# Altium schematic sheet Sheet1 (2).SchDoc
size 420 x 297 mm; Address1: Address1; Address2: Address2; Address3: Address3; Address4: Address4; DocumentNumber: АБВГ.123456.001 Э3; SheetNumber: 1; SheetTotal: 2; Scale: 1:1; Title2str: Макет преобразователя частоты вращения.; DocumentType: Схема электрическая принципиальная; FirstReferrence: АБВГ.123456.001
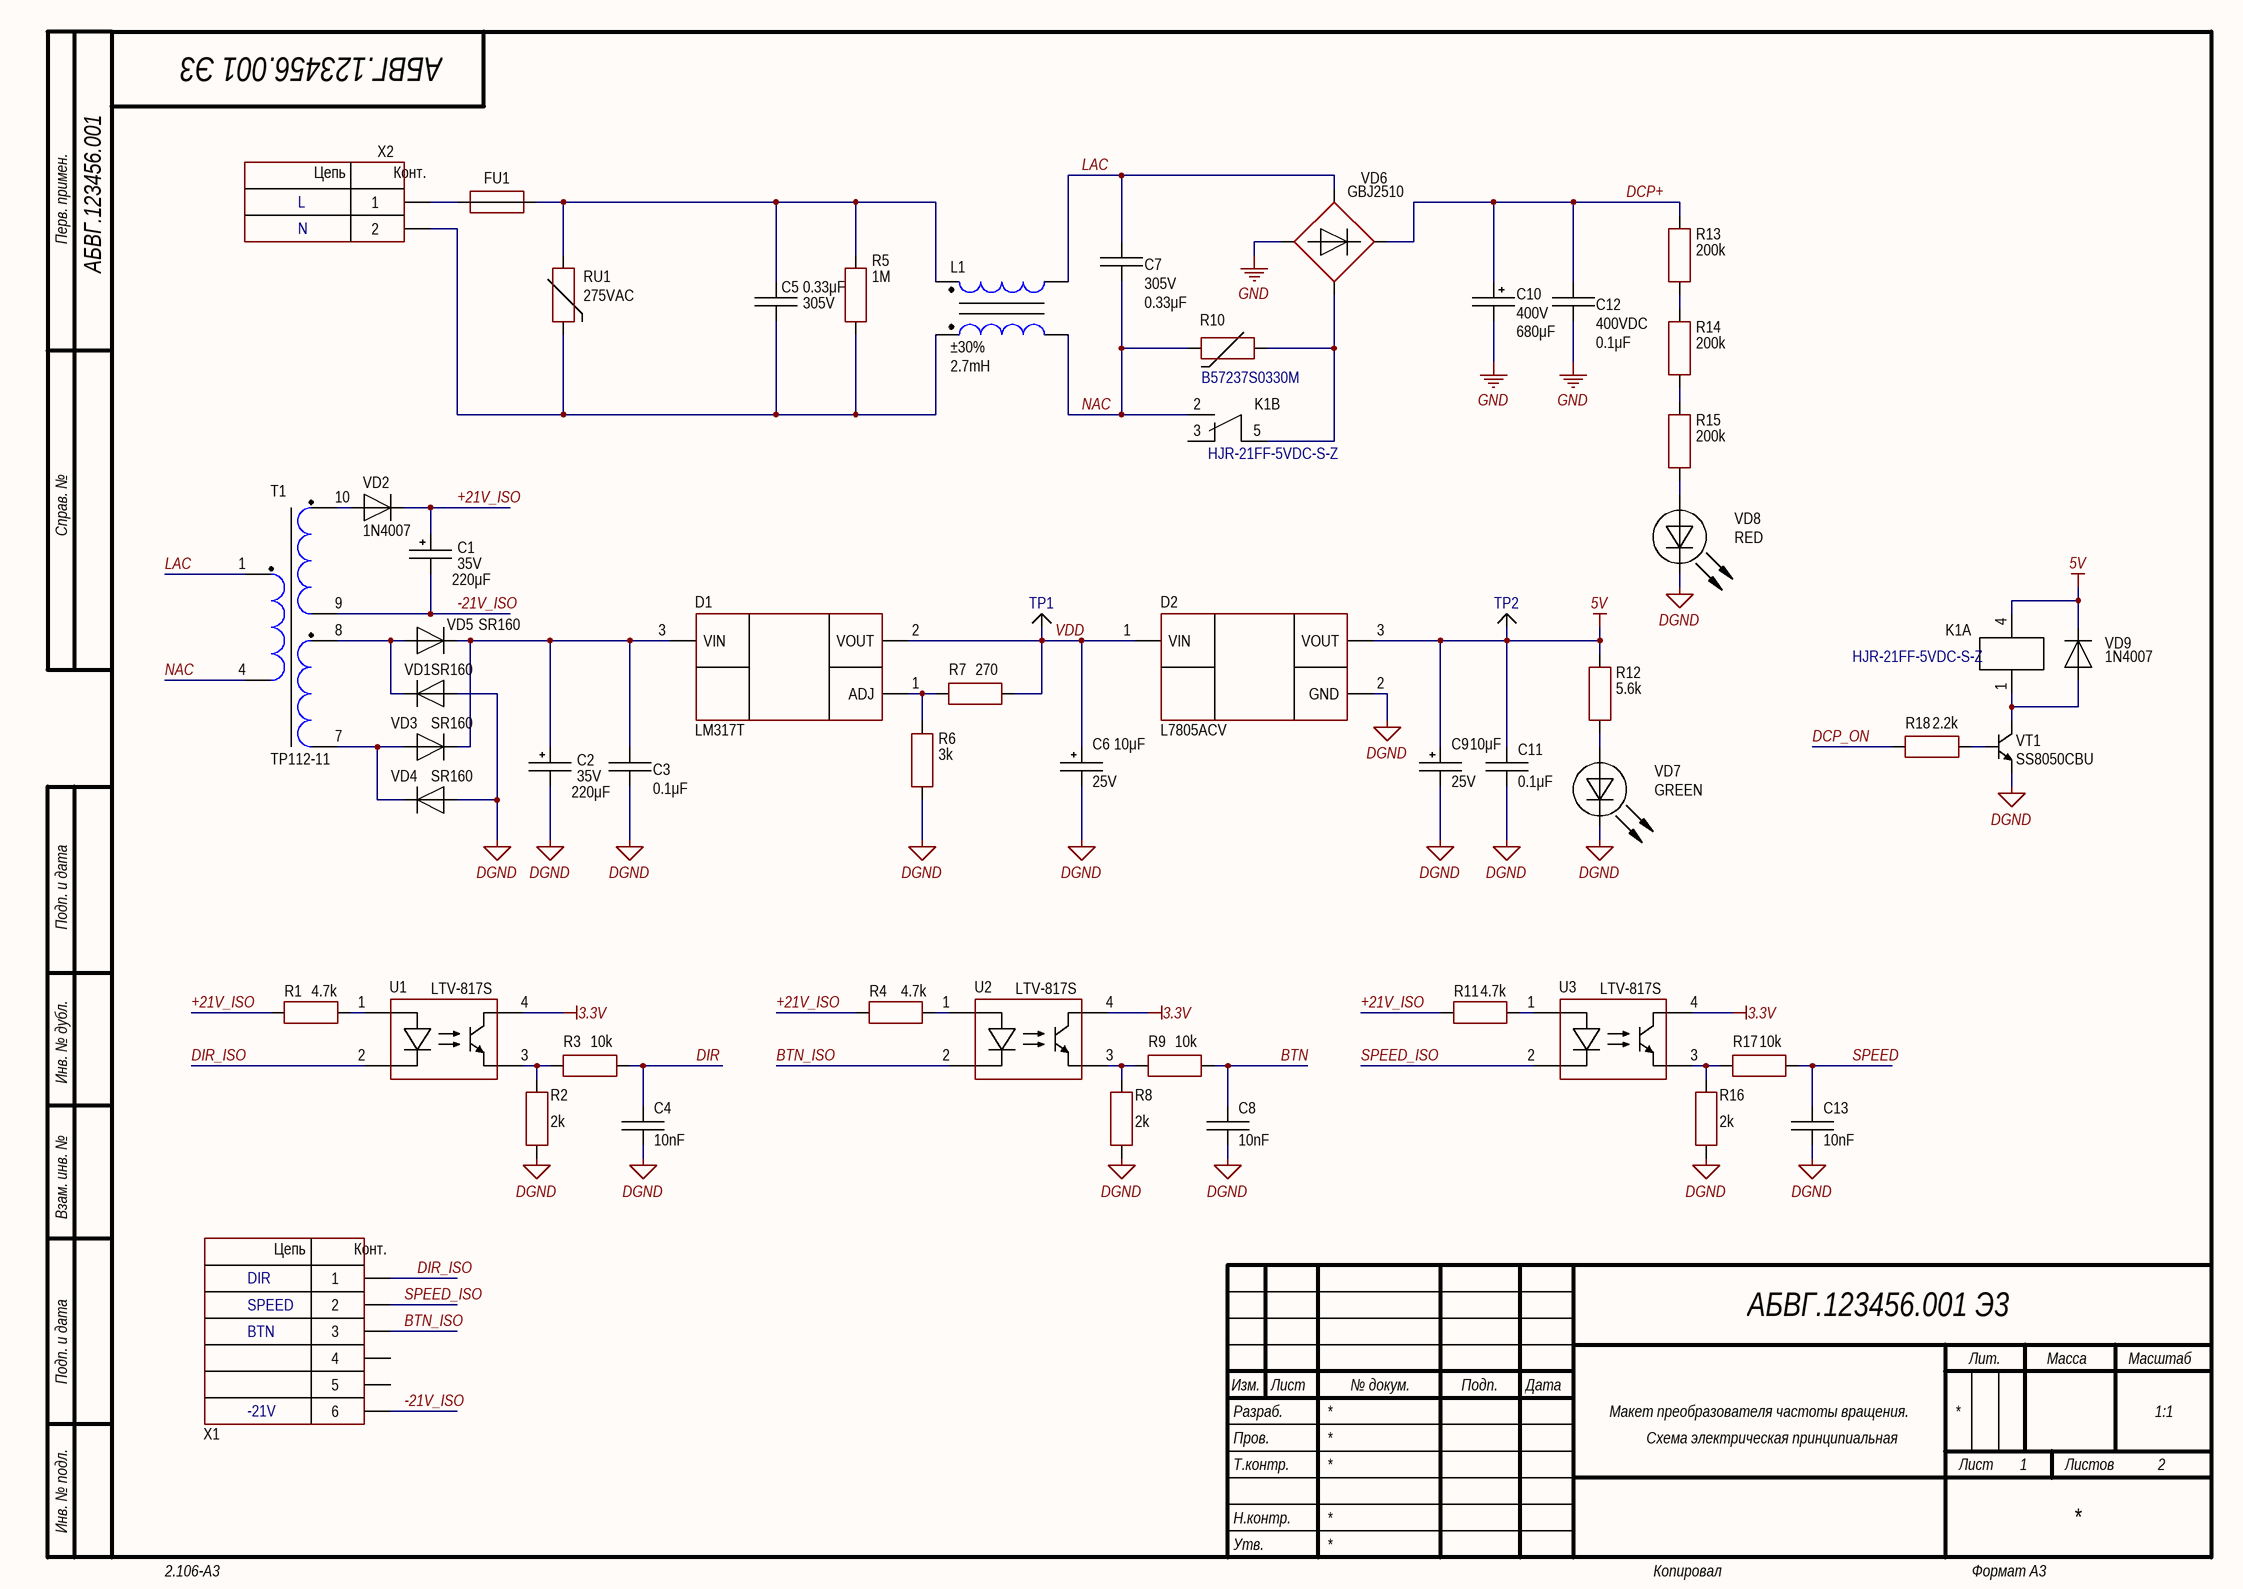
[diagram p0: Sheet1 (2).SchDoc]

## Parts
C1  value 220μF  Voltage: 35V  [CAP: D8C3.5H12]
C2  value 220μF  Voltage: 35V  [CAP: D8C3.5H12]
C3  value 0.1μF  [CAP: 1206]
C4  value 10nF  [CAP: 1206]
C5  value 0.33μF  Voltage: 305V  [CAP: B32922]
C6  value 10μF  Voltage: 25V  [CAP: D5C2H11]
C7  value 0.33μF  Voltage: 305V  [CAP: B32922]
C8  value 10nF  [CAP: 1206]
C9  value 10μF  Voltage: 25V  [CAP: D5C2H11]
C10  value 680μF  Voltage: 400V  [CAP: D30C10H37]
C11  value 0.1μF  [CAP: 1206]
C12  value 0.1μF  Voltage: 400VDC  [CAP: B32673]
C13  value 10nF  [CAP: 1206]
D1  PartNumber: LM317T  [TO-220F]
D2  PartNumber: L7805ACV  [TO-220F]
FU1  (no value)  [FUSE: FH-101]
K1  Relay, Non Latching, SPDT , 10A , (250VAC , 110VDC)  [HJR-21FF-5VDC-S-Z]  (value not drawn)  (parts A,B of 2)
L1  value 2.7mH  Tolerance: ±30%  [IND: B82723A]
R1  value 4.7k  [RES: 1206]
R2  value 2k  [RES: 1206]
R3  value 10k  [RES: 1206]
R4  value 4.7k  [RES: 1206]
R5  value 1M  [RES: Axial 15mm]  (hidden comment: *)
R6  value 3k  [RES: 1206]
R7  value 270  [RES: 1206]
R8  value 2k  [RES: 1206]
R9  value 10k  [RES: 1206]
R10  PartNumber: B57237S0330M  [RES: B57237 (NTC)]
R11  value 4.7k  [RES: 1206]
R12  value 5.6k  [RES: 1206]
R13  value 200k  [RES: 1206]
R14  value 200k  [RES: 1206]
R15  value 200k  [RES: 1206]
R16  value 2k  [RES: 1206]
R17  value 10k  [RES: 1206]
R18  value 2.2k  [RES: 1206]
RU1  MaxVoltage: 275VAC  [VARISTOR: B72214]
T1  Package: TP112-11  [TRANS: TP-112]
TP1  Test_Point  [TEST POINT KEYSTONE]  (value not drawn)
TP2  Test_Point  [TEST POINT KEYSTONE]  (value not drawn)
U1  PartNumber: LTV-817S  [4-SMD]
U2  PartNumber: LTV-817S  [4-SMD]
U3  PartNumber: LTV-817S  [4-SMD]
VD1  PartNumber: SR160  [DIODE: DO41]
VD2  PartNumber: 1N4007  [DIODE: DO41]
VD3  PartNumber: SR160  [DIODE: DO41]
VD4  PartNumber: SR160  [DIODE: DO41]
VD5  PartNumber: SR160  [DIODE: DO41]
VD6  (no value)  [DIODE: GBJ FLAT]
VD7  Color: GREEN  [LED: Axial 3MM GREEN]
VD8  Color: RED  [LED: Axial 3MM RED]
VD9  PartNumber: 1N4007  [DIODE: DO41]
VT1  (no value)  [TO-92 - formed leads]
X1  (no value)  [CON: PLS-6]
X2  (no value)  [DG128-7.5-02P]

## Nets
3.3V: U1.4(C) U2.4(C) U3.4(C)
5V: C9.1 C11.2 D2.3(VOUT) K1.4 R12.2 TP2.1 VD9.2
DGND: C2.2 C3.1 C4.1 C6.2 C8.1 C9.2 C11.1 C13.1 D2.2(GND) R2.1 R6.1 R8.1 R16.1 VD1.1 VD4.1 VD7.2(C) VD8.2(C) VT1.1(E)
GND: C10.2 C12.2 VD6.1
+21V_ISO: C1.1 R1.1 R4.1 R11.1 VD2.2
-21V_ISO: C1.2 T1.9 X1.6
BTN: C8.2 R9.1
BTN_ISO: U2.2(C) X1.3
DCP+: C10.1 C12.1 R13.2 VD6.3
DCP_ON: R18.1
DIR: C4.2 R3.1
DIR_ISO: U1.2(C) X1.1
LAC: C7.1 L1.1 T1.1 VD6.2
NAC: C7.2 K1.2 L1.4 R10.2 T1.4
SPEED: C13.2 R17.1
SPEED_ISO: U3.2(C) X1.2
VDD: C6.1 D1.2(VOUT) D2.1(VIN) R7.2 TP1.1
NetC2_1: C2.1 C3.2 D1.3(VIN) VD3.2 VD5.2
NetC5_1: C5.1 FU1.2 L1.2 R5.2 RU1.1
NetC5_2: C5.2 L1.3 R5.1 RU1.2 X2.2
NetD1_1: D1.1(ADJ) R6.2 R7.1
NetFU1_1: FU1.1 X2.1
NetK1_1: K1.1 VD9.1 VT1.3(C)
NetK1_5: K1.5 R10.1 VD6.4
NetR1_2: R1.2 U1.1(A)
NetR2_2: R2.2 R3.2 U1.3(E)
NetR4_2: R4.2 U2.1(A)
NetR8_2: R8.2 R9.2 U2.3(E)
NetR11_2: R11.2 U3.1(A)
NetR12_1: R12.1 VD7.1(A)
NetR13_1: R13.1 R14.2
NetR14_1: R14.1 R15.2
NetR15_1: R15.1 VD8.1(A)
NetR16_2: R16.2 R17.2 U3.3(E)
NetR18_2: R18.2 VT1.2(B)
NetT1_7: T1.7 VD3.1 VD4.2
NetT1_8: T1.8 VD1.2 VD5.1
NetT1_10: T1.10 VD2.1

Not connected (* = marked no-connect by the designer): K1 3; X1 4 5

## Notes on the sheet
- L
- N
- DIR
- SPEED
- BTN
- -21V
- Перв. примен.
- Справ. №
- Подп. и дата
- Инв. № дубл.
- Взам. инв. №
- Разраб.
- Изм.
- Лист
- № докум.
- Подп.
- Дата
- Лит.
- Масса
- Масштаб
- Пров.
- Т.контр.
- Листов
- Инв. № подл.
- Утв.
- Н.контр.
- 2.106-A3
- Копировал
- Формат А3
- (in symbol KLS2-128-7.50-02P-4S (DG128-7.5-02P)) Цепь; Конт.
- (in symbol PLS-6) Цепь; Конт.

## Library data of the parts
C1 C2 = Aluminium: PartNumber: 9000565901; ValueManufacturerPartNumber: Aluminium capacitor, 220μF, 35V, ±20%, 54mOhm, 8x12x3.5 mm, -40...+105°C; TypeCapacitor: Aluminium capacitor; Tolerance: ±20%; Impedance: 54mOhm; Art: 9000565902; Manufacturer: ?; Package: 8x12x3.5 mm; HelpURL: https://www.chipdip.ru/product0/9000565902; Temperature: -40...+105°C; Price ChipDip: 13
C3 C11 = Ceramic_1206: PartNumber: Ceramic capacitor, 0.1μF,   50V; ValueManufacturerPartNumber: Ceramic capacitor, 0.1μF, X7R, ±10%, 50V, 1206, -55...+125°C; TypeCapacitor: Ceramic capacitor; Tolerance: ±10%; TypeDielectric: X7R; Voltage: 50V; Manufacturer: *; Package: 1206; HelpURL: https://www.chipdip.ru/product0/42211; Temperature: -55...+125°C; Price ChipDip: 11
C4 C8 C13 = Ceramic_1206: PartNumber: Ceramic capacitor, 10nF,   50V; ValueManufacturerPartNumber: Ceramic capacitor, 10nF, X7R, ±10%, 50V, 1206, -55...+125°C; TypeCapacitor: Ceramic capacitor; Tolerance: ±10%; TypeDielectric: X7R; Voltage: 50V; Manufacturer: *; Package: 1206; HelpURL: https://www.chipdip.ru/product0/17180; Temperature: -55...+125°C; Price ChipDip: 13
  C4: ClassName: optoiso1
  C8: ClassName: optoiso2
  C13: ClassName: optoiso3
C5 C7 = Film: Manufacturer: Epcos; PartNumber: B32922-C3334-K; ValueManufacturerPartNumber: Film capacitor X2, 0.33μF, 305V, ±10%, ?, 18x14x8, -40...+110°C; TypeCapacitor: Film capacitor X2; Tolerance: ±10%; Package: 18x14x8; HelpURL: https://www.chipdip.ru/product/b32922-c3334-k; Temperature: -40...+110°C; Impedance: ?; Price ChipDip: 59
C6 C9 = Aluminium: PartNumber: 9000565842; ValueManufacturerPartNumber: Aluminium capacitor, 10μF, 25V, ±20%, 54mOhm, ?, -40...+105°C; TypeCapacitor: Aluminium capacitor; Tolerance: ±20%; Impedance: 54mOhm; Manufacturer: ?; Package: ?; HelpURL: https://www.chipdip.ru/product0/9000565842; Temperature: -40...+105°C; Price ChipDip: 9; Art: 9000565842
C10 = Aluminium: Manufacturer: JB Capacitors; PartNumber: JNE2G681M10003000600; ValueManufacturerPartNumber: Aluminium capacitor, 680μF, 400V, ±20%, ?, 30x10x60 mm, -25...+105°C; TypeCapacitor: Aluminium capacitor; Tolerance: ±20%; Art: 9000565973; Package: 30x10x60 mm; HelpURL: https://www.chipdip.ru/product0/9000565973; Temperature: -25...+105°C; Impedance: ?; Price ChipDip: 700; Price Ali: 853
C12 = Film: Manufacturer: Epcos; PartNumber: B32683A4104J000; ValueManufacturerPartNumber: Film capacitor, 0.1μF, 400VDC, ±10%, ?, 26.5x16.5x8.5 mm, -55...+100°C; TypeCapacitor: Film capacitor; Tolerance: ±10%; Package: 26.5x16.5x8.5 mm; HelpURL: https://www.chipdip.ru/product0/9000614069; Temperature: -55...+100°C; Impedance: ?; Price ChipDip: 160; Price Ali: 90
D1 = LM317: Adjustable voltage regulator; Manufacturer: STMicroelectronics; VoltageInput: 1.2…37V; CurrentOutput: 1.5A; Art: 268916202; HelpURL: https://www.chipdip.ru/product/lm317t; Package: TO-220SG; ComponentType: Adjustable voltage regulator; ValueManufacturerPartNumber: =TypeTransistor+', '+VoltageCE+', '+CurrentCE+', '+Frequency+', '+MaxPower+', '+VoltageSaturation+', '+CurrentGain+', '+Package+', '+Temperature; Temperature: 0...125°C; MaxDropout: *; VoltageOutput: *; Price ChipDip: 60
D2 = 78XX: Linear voltage regulator; Manufacturer: STMicroelectronics; VoltageInput: 35V; CurrentOutput: 1.5A; VoltageOutput: 5V; Art: 9000107125; HelpURL: https://www.chipdip.ru/product/l7805acv-dg; Package: *; ComponentType: Linear voltage regulator; ValueManufacturerPartNumber: =TypeTransistor+', '+VoltageCE+', '+CurrentCE+', '+Frequency+', '+MaxPower+', '+VoltageSaturation+', '+CurrentGain+', '+Package+', '+Temperature; Temperature: *; MaxDropout: *; Price ChipDip: 41
FU1 = FUSE: Manufacturer: Dragon City Industries; PartNumber: FH-101; ValueManufacturerPartNumber: *,  FH-101, *; Art: 45989; Package: FH-101; HelpURL: https://www.chipdip.ru/product/fh-101; Temperature: *; Value: *; Price ChipDip: 38
K1 = HJR-21FF-5VDC-S-Z: Manufacturer: Tianbo; CurrentMax: 15A; Switching Voltage: (250VAC , 30VDC) Max; Coil Voltage: 5VDC; Art: 8007062022; HelpURL: https://www.chipdip.ru/product0/8007062022; Price ChipDip: 37; PartNumber: HJR-21FF-5VDC-S-Z
L1 = B82723A: Manufacturer: TDK (TDK-Lambda); PartNumber: B82723A2402N1; TypeInductor: Fixed inductor; TypeMatiriel: CuNi18Zn20; Stray inductance: 30uH; Rated voltage: 250V; Package: B82723A; HelpURL: https://www.chipdip.ru/product0/8534720954; ValueManufacturerPartNumber: =TypeInductor+', '+Value+', '+Tolerance+', '+Package+', '+TypeMatiriel+', '+AL; Price ChipDip: 400
R1 R4 R11 = Resistor_1206: Manufacturer: Yageo; PartNumber: RC1206JR-07100RL; ValueManufacturerPartNumber: Resistor film, 4.7k, ±5%, 1206, 0.25W, -55...+125°C; TypeResistor: Resistor film; Power: 0.25W; Tolerance: ±5%; Package: 1206; HelpURL: https://www.digikey.com/product-detail/en/yageo/RC1206JR-07100RL/311-100ERCT-ND/732153; Temperature: -55...+125°C
  R1: ClassName: optoiso1
  R4: ClassName: optoiso2
  R11: ClassName: optoiso3
R2 R8 R16 = Resistor_1206: Manufacturer: Yageo; PartNumber: RC1206JR-07100RL; ValueManufacturerPartNumber: Resistor film, 2k, ±5%, 1206, 0.25W, -55...+125°C; TypeResistor: Resistor film; Power: 0.25W; Tolerance: ±5%; Package: 1206; HelpURL: https://www.digikey.com/product-detail/en/yageo/RC1206JR-07100RL/311-100ERCT-ND/732153; Temperature: -55...+125°C
  R2: ClassName: optoiso1
  R8: ClassName: optoiso2
  R16: ClassName: optoiso3
R3 R9 R17 = Resistor_1206: Manufacturer: Yageo; PartNumber: RC1206JR-07100RL; ValueManufacturerPartNumber: Resistor film, 10k, ±5%, 1206, 0.25W, -55...+125°C; TypeResistor: Resistor film; Power: 0.25W; Tolerance: ±5%; Package: 1206; HelpURL: https://www.digikey.com/product-detail/en/yageo/RC1206JR-07100RL/311-100ERCT-ND/732153; Temperature: -55...+125°C
  R3: ClassName: optoiso1
  R9: ClassName: optoiso2
  R17: ClassName: optoiso3
R5 = Resistor_Axial: Tolerance: ±5%; Manufacturer: *; PartNumber: *; Package: *; HelpURL: *; ValueManufacturerPartNumber: *; Temperature: *; TypeResistor: *; Power: *
R6 = Resistor_1206: Manufacturer: Yageo; PartNumber: RC1206JR-07100RL; ValueManufacturerPartNumber: Resistor film, 3k, ±5%, 1206, 0.25W, -55...+125°C; TypeResistor: Resistor film; Power: 0.25W; Tolerance: ±5%; Package: 1206; HelpURL: https://www.digikey.com/product-detail/en/yageo/RC1206JR-07100RL/311-100ERCT-ND/732153; Temperature: -55...+125°C
R7 = Resistor_1206: Manufacturer: Yageo; PartNumber: RC1206JR-07100RL; ValueManufacturerPartNumber: Resistor film, 270, ±5%, 1206, 0.25W, -55...+125°C; TypeResistor: Resistor film; Power: 0.25W; Tolerance: ±5%; Package: 1206; HelpURL: https://www.digikey.com/product-detail/en/yageo/RC1206JR-07100RL/311-100ERCT-ND/732153; Temperature: -55...+125°C
R10 = NTC: Maximum permissible capacitance 900uF; Manufacturer: Epcos; ValueManufacturerPartNumber: NTC resistor, 33, ±20%, pitch 7.5mm, 2.5A, -55...+170°C; TypeResistor: NTC resistor; MaxCurrent: 2.5A; Tolerance: ±20%; Value: 33; Art: 8010235420; Package: pitch 7.5mm; HelpURL: https://www.chipdip.ru/product0/8010235420; Temperature: -55...+170°C; Price ChipDip: 38
R12 = Resistor_1206: Manufacturer: Yageo; PartNumber: RC1206JR-07100RL; ValueManufacturerPartNumber: Resistor film, 5.6k, ±5%, 1206, 0.25W, -55...+125°C; TypeResistor: Resistor film; Power: 0.25W; Tolerance: ±5%; Package: 1206; HelpURL: https://www.digikey.com/product-detail/en/yageo/RC1206JR-07100RL/311-100ERCT-ND/732153; Temperature: -55...+125°C
R13-R15 = Resistor_1206: Manufacturer: Yageo; PartNumber: RC1206JR-07100RL; ValueManufacturerPartNumber: Resistor film, 200k, ±5%, 1206, 0.25W, -55...+125°C; TypeResistor: Resistor film; Power: 0.25W; Tolerance: ±5%; Package: 1206; HelpURL: https://www.digikey.com/product-detail/en/yageo/RC1206JR-07100RL/311-100ERCT-ND/732153; Temperature: -55...+125°C
R18 = Resistor_1206: Manufacturer: Yageo; PartNumber: RC1206JR-07100RL; ValueManufacturerPartNumber: Resistor film, 2.2k, ±5%, 1206, 0.25W, -55...+125°C; TypeResistor: Resistor film; Power: 0.25W; Tolerance: ±5%; Package: 1206; HelpURL: https://www.digikey.com/product-detail/en/yageo/RC1206JR-07100RL/311-100ERCT-ND/732153; Temperature: -55...+125°C
RU1 = Varistor: Manufacturer: EPCOS; PartNumber: B72214-S 271-K101; ValueManufacturerPartNumber: Varistor, 275VAC, pitch 7mm,  -40…85°C; Package: pitch 7mm; HelpURL: https://www.chipdip.ru/product/b72214-s271-k101; Temperature: -40…85°C; TypeResistor: Varistor; Price ChipDip: 36
T1 = TP-112: ValueManufacturerPartNumber: Transformer, TP112-11; TypeTransformer: Transformer; Art: 26337; Manufacturer: ?; HelpURL: https://www.chipdip.ru/product/tp112-11; PartNumber: TP112-11
U1-U3 = LTV-817: Optoisolator; Manufacturer: Lite-On; ValueManufacturerPartNumber: IC optoisolator, 4µs/3µs, 5000Vrms, 35V, -40...+125°C, 4-SMD; Supply: 35V; DataRate: 4µs/3µs; Isolation: 5000Vrms; Art: 972167119; HelpURL: https://www.chipdip.ru/product/pc817-ltv817s; Package: 4-SMD; ComponentType: IC optoisolator; Temperature: -40...+125°C; Price ChipDip: 24
  U1: ClassName: optoiso1
  U2: ClassName: optoiso2
  U3: ClassName: optoiso3
VD1 VD3-VD5 = Diode_single: Manufacturer: China; ValueManufacturerPartNumber: Single diode, 60V, 1A, 700mV, ?, DO-41,  -65…+150°C; TypeDiode: Single diode; Voltage: 60V; Current: 1A; VoltageDrop: 700mV; Art: 20950; Package: DO-41; HelpURL: https://www.chipdip.ru/product/sr160; Temperature: -65…+150°C; RecoveryTime: ?; Price ChipDip: 24
VD2 VD9 = Diode_single: Manufacturer: Diotec Semiconductor; ValueManufacturerPartNumber: Single diode, 1000V, 1A, 1.1V, , DO-41, -65...+175 C; TypeDiode: Single diode; Voltage: 1000V; Current: 1A; VoltageDrop: 1.1V; Package: DO-41; HelpURL: https://www.chipdip.ru/product/1n4007; Temperature: -65...+175 C; Price ChipDip: 5
VD6 = GBJ2510: Manufacturer: DIODES INC.; ValueManufacturerPartNumber: Single phase rectifier, 1000V, 25A, 1.05V, GBJ, -56...+150°C; TypeDiode: Single phase rectifier; Voltage: 1000V; Current: 25A; VoltageDrop: 1.05V; Package: GBJ; HelpURL: https://www.chipdip.ru/product/gbj2510-f; Temperature: -56...+150°C; PartNumber: GBJ2510; Price ChipDip: 290
VD7 = LED_single: ValueManufacturerPartNumber: LED, Green, *, *, *, -55...+150°C; PartNumber: Green Led; TypeDiode: LED; Art: 9000811962; Manufacturer: *; Package: *; HelpURL: *; Temperature: -55...+150°C; Current: *; VoltageDrop: *; ColorParameter: Green
VD8 = LED_single: ValueManufacturerPartNumber: LED, RED, *, *, *, -55...+150°C; PartNumber: Red Led; TypeDiode: LED; Art: 9000811962; Manufacturer: *; Package: *; HelpURL: *; Temperature: -55...+150°C; Current: *; VoltageDrop: *; ColorParameter: RED
VT1 = SS8050CBU: Manufacturer: ON Semiconductor; ValueManufacturerPartNumber: NPN transistor, 40V, 1.5A, 190MHz, 1W, 0.5Vmax, 120...200, TO-92, 150°C; TypeTransistor: NPN transistor; VoltageCE: 40V; CurrentCE: 1.5A; VoltageSaturation: 0.5Vmax; Frequency: 190MHz; CurrentGain: 120...200; MaxPower: 1W; Art: 32257; Package: TO-92; HelpURL: https://www.chipdip.ru/product/s8050; Temperature: 150°C; Price ChipDip: 19; PartNumber: SS8050CBU
X1 = PLS-6: Manufacturer: Connfly; ValueManufacturerPartNumber: Connector, 6pin, 2.54mm, 500VAC, 3A; TypeConnector: Connector; VoltageMax: 500VAC; Pitch: 2.54mm; CurrentMax: 3A; Multichannel: 6pin; CommentText: "Разъем"; Art: 389965514; HelpURL: https://www.chipdip.ru/product/pls-6; PartNumber: PLS-6; Price ChipDip: 8
X2 = KLS2-128-7.50-02P-4S (DG128-7.5-02P): Manufacturer: KLS electronic co ltd; ValueManufacturerPartNumber: Connector, 2pin, 9.53mm, 300VAC, 16A; TypeConnector: Connector; VoltageMax: 300VAC; Pitch: 9.53mm; CurrentMax: 16A; Multichannel: 2pin; CommentText: "Разъем"; Art: 9000357654; HelpURL: https://www.chipdip.ru/product/kls2-128-7.50-02p-4s-dg128-7.5-02p; PartNumber: KLS2-128-7.50-02P-4S; Price ChipDip: 16